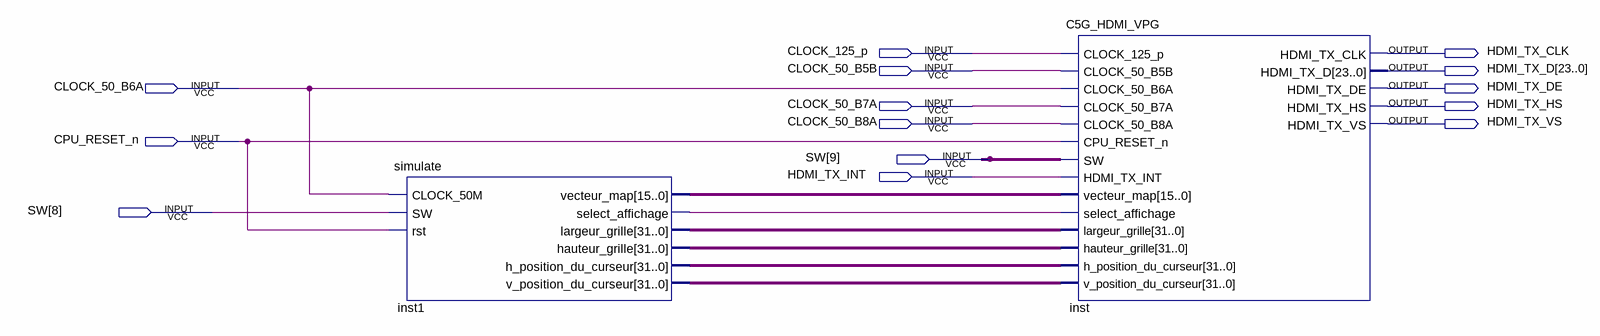
[diagram p0: schematic sheet]
// Quartus schematic test_simul.bdf as structural Verilog: 2 symbols, 14 pins
module test_simul (
  input  CLOCK_125_p,
  input  CLOCK_50_B5B,
  input  CLOCK_50_B6A,
  input  CLOCK_50_B7A,
  input  CLOCK_50_B8A,
  input  CPU_RESET_n,
  input  [9:8] SW,
  input  HDMI_TX_INT,
  output HDMI_TX_CLK,
  output [23:0] HDMI_TX_D,
  output HDMI_TX_DE,
  output HDMI_TX_HS,
  output HDMI_TX_VS
);

  wire inst1_select_affichage;
  wire [15:0] inst1_vecteur_map;
  wire [31:0] inst1_h_position_du_curseur, inst1_hauteur_grille, inst1_largeur_grille,
       inst1_v_position_du_curseur;

  simulate inst1 (
    .CLOCK_50M(CLOCK_50_B6A), .SW(SW[8]), .rst(CPU_RESET_n), .vecteur_map(inst1_vecteur_map),
    .select_affichage(inst1_select_affichage), .largeur_grille(inst1_largeur_grille),
    .hauteur_grille(inst1_hauteur_grille), .h_position_du_curseur(inst1_h_position_du_curseur),
    .v_position_du_curseur(inst1_v_position_du_curseur));
  C5G_HDMI_VPG inst (
    .CLOCK_125_p(CLOCK_125_p), .CLOCK_50_B5B(CLOCK_50_B5B), .CLOCK_50_B6A(CLOCK_50_B6A),
    .CLOCK_50_B7A(CLOCK_50_B7A), .CLOCK_50_B8A(CLOCK_50_B8A), .CPU_RESET_n(CPU_RESET_n), .SW(SW[9]),
    .HDMI_TX_INT(HDMI_TX_INT), .vecteur_map(inst1_vecteur_map), .select_affichage(inst1_select_affichage),
    .largeur_grille(inst1_largeur_grille), .hauteur_grille(inst1_hauteur_grille),
    .h_position_du_curseur(inst1_h_position_du_curseur), .v_position_du_curseur(inst1_v_position_du_curseur),
    .HDMI_TX_CLK(HDMI_TX_CLK), .HDMI_TX_D(HDMI_TX_D), .HDMI_TX_DE(HDMI_TX_DE), .HDMI_TX_HS(HDMI_TX_HS),
    .HDMI_TX_VS(HDMI_TX_VS));
endmodule
